# Altium schematic sheet PSoC.SchDoc
size A; SheetNumber: 6; SheetTotal: 7
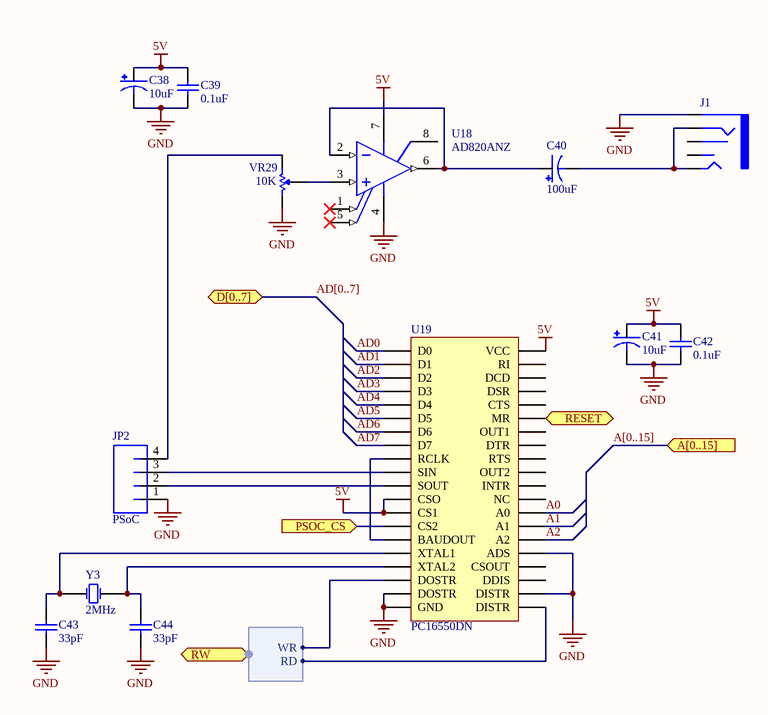
[diagram p0: PSoC.SchDoc]

## Parts
C38  10uF  [CPOL-RADIAL]
C39  0.1uF  [CAP-PTH]
C40  100uF  [CPOL-RADIAL-100UF-25V]
C41  10uF  [CPOL-RADIAL]
C42  0.1uF  [CAP-PTH]
C43  33pF  [CAP-PTH]
C44  33pF  [CAP-PTH]
J1  (no value)  [AUDIO_JACK]
JP2  PSoC  [JST-PH-4-PTH-HORZ]
U18  AD820ANZ  [ADI-N-8]
U19  PC16550DN  [PDIP-40]
VR29  10K  [ROTARY_POT]
Y3  2MHz  [CRYSTAL_PTH]

## Ports
A[0..15] (in), D[0..7] (bidir), PSOC_CS (in), RESET (in), RW (harness RW)

## Harnesses
RW: WR, RD

## Nets
5V: C38.1(+) C39.1 C41.1(+) C42.1 U18.7(+VS) U19.12(CSO) U19.13(CS1) U19.40(VCC)
GND: C38.2(-) C39.2 C41.2(-) C42.2 C43.2 C44.2 J1.SLEEVE JP2.1 U18.4(-VS) U19.19(DOSTR) U19.20(GND) U19.22(DISTR) U19.25(ADS) VR29.3
A0: U19.28(A0)
A1: U19.27(A1)
A2: U19.26(A2)
AD0: U19.1(D0)
AD1: U19.2(D1)
AD2: U19.3(D2)
AD3: U19.4(D3)
AD4: U19.5(D4)
AD5: U19.6(D5)
AD6: U19.7(D6)
AD7: U19.8(D7)
PSOC_CS: U19.14(CS2) ; port PSOC_CS
RESET: U19.35(MR) ; port RESET
NetC40_1: C40.1(+) U18.2(-IN) U18.6(VOUT)
NetC40_2: C40.2(-) J1.RING J1.TIP
NetC43_1: C43.1 U19.16(XTAL1) Y3.1(X1)
NetC44_1: C44.1 U19.17(XTAL2) Y3.2(X2)
NetJP2_2: JP2.2 U19.11(SOUT)
NetJP2_3: JP2.3 U19.10(SIN)
NetJP2_4: JP2.4 VR29.1
NetU18_3: U18.3(+IN) VR29.2
NetU19_9: U19.9(RCLK) U19.15(BAUDOUT)
NetU19_18: U19.18(DOSTR) ; port RW.WR
NetU19_21: U19.21(DISTR) ; port RW.RD

Not connected (* = marked no-connect by the designer): J1 RSH TSH; U18 1(NULL)* 5(NULL)* 8(NC); U19 23(DDIS) 24(CSOUT) 29(NC) 30(INTR) 31(OUT2) 32(RTS) 33(DTR) 34(OUT1) 36(CTS) 37(DSR) 38(DCD) 39(RI)

## Buses and harness runs
bus A[0..15] = port A[0..15]
bus AD[0..7] = port D[0..7]

## Library data of the parts
C38 C41 = PolarizedCap
C39 C42-C44 = Cap
C40 = PolarizedCap-100uF
J1 = AudioJack
JP2 = JST_PH_4_HORZ: PartNumber: S4B-PH-K-S(LF)(SN); Manufacturer: JST Sales America Inc.; PackageReference: JST-PH; Mounting Technology: Through Hole
U18 = CMP-0384-00229-1: Single Channel Rail-to-Rail Operational Amplifier, 1.9 MHz BW, 3 V/us SR, Industrial, 8-pin DIP (N-8), Tube; Manufacturer: Analog Devices; Generic Part Number: AD820; Small Signal Bandwidth: 1.9MHz; V Span Min: 5V; Amplifiers Per Package: 1; V Span Max: 36V; Input Offset Voltage: 100uV; Slew Rate: 3V/us; Input Bias Current: 2pA; Iq/Amp: 900uA; ComponentLink2Description: Datasheet; PackageReference: N-8; Code_JEDEC: MS-001; PartNumber: AD820ANZ; PackageVersion: 070606-A; ComponentLink1URL: http://www.analog.com/en/index.html; PackageDescription: 8-Pin Plastic Dual In-Line Package, Row spacing 7.62 mm, Pitch 2.54 mm; DatasheetVersion: Rev. H; ComponentLink3URL: http:/www.analog.com/static/imported-files/packages/PKG_PDF/PDIP(N)/N_8.pdf; ComponentLink2URL: http://www.analog.com/static/imported-files/data_sheets/AD820.pdf; Mounting Technology: Through Hole; ComponentLink3Description: Package Specification; ComponentLink1Description: Manufacturer URL
U19 = PC16550DN: Manufacturer: Texas Instruments; PartNumber: PC16550DN; Mounting Technology: Through Hole; PackageReference: PDIP-40
VR29 = RotaryPot
Y3 = Crystal